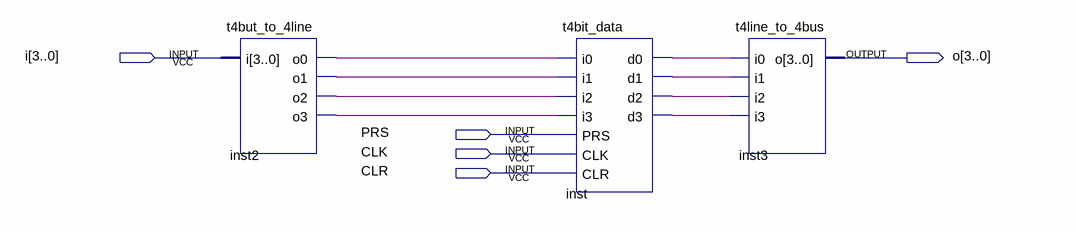
[diagram p0: schematic sheet]
// Quartus schematic t4bits_bus_data.bdf as structural Verilog: 3 symbols, 5 pins
module t4bits_bus_data (
  input  [3:0] i,
  input  PRS,
  input  CLK,
  input  CLR,
  output [3:0] o
);

  wire inst2_o0, inst2_o1, inst2_o2, inst2_o3, inst_d0, inst_d1, inst_d2, inst_d3;

  t4but_to_4line inst2 (.i(i), .o0(inst2_o0), .o1(inst2_o1), .o2(inst2_o2), .o3(inst2_o3));
  t4bit_data inst (
    .i0(inst2_o0), .i1(inst2_o1), .i2(inst2_o2), .i3(inst2_o3), .PRS(PRS), .CLK(CLK), .CLR(CLR),
    .d0(inst_d0), .d1(inst_d1), .d2(inst_d2), .d3(inst_d3));
  t4line_to_4bus inst3 (.i0(inst_d0), .i1(inst_d1), .i2(inst_d2), .i3(inst_d3), .o(o));
endmodule
